# Altium schematic sheet RELAY17.SchDoc
size A
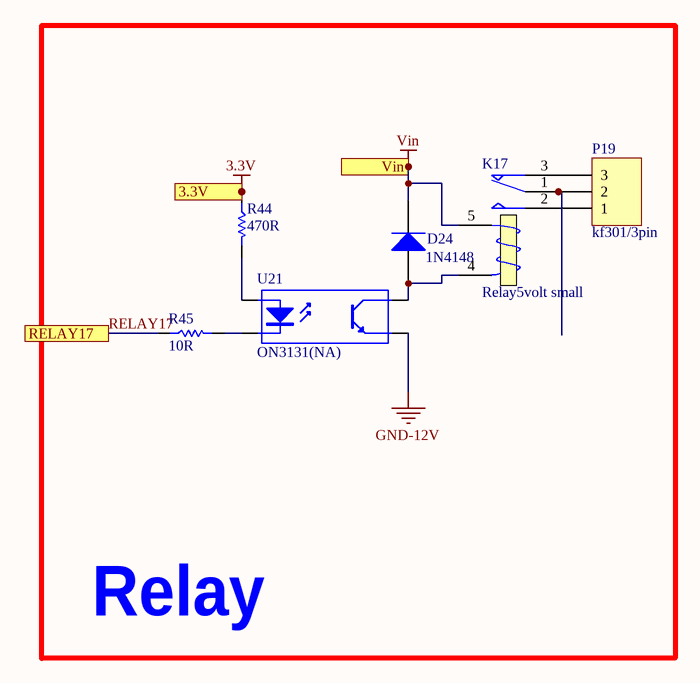
[diagram p0: RELAY17.SchDoc]

## Parts
D24  1N4148  [sod123]
K17  Relay5volt small  [relay5_childern]
P19  kf301/3pin  [Blue Connector 1*3 -kf301]
R44  470R  [0805/resistor]
R45  10R  [0805/resistor]
U21  ON3131(NA)  [OPTO_COUPLER]

## Blocks framed on the sheet
Relay: D24 K17 P19 R44 R45 U21

## Ports
3.3V, RELAY17, Vin

## Nets
3.3V: R44.1 ; port 3.3V
GND-12V: U21.3(E)
Vin: D24.K K17.5 ; port Vin
RELAY17: R45.1 ; port RELAY17
NetD24_A: D24.A K17.4(T2) U21.4(C)
NetK17_1: K17.1(COM) P19.2
NetK17_2: K17.2(NO) P19.1
NetK17_3: K17.3(T1) P19.3
NetR44_2: R44.2 U21.1(A)
NetR45_2: R45.2 U21.2(K)

## Library data of the parts
D24 = Diode 1N4007: 1 Amp General Purpose Rectifier; Published: 8-Jun-2000; LatestRevisionDate: 17-Jul-2002; LatestRevisionNote: Re-released for DXP Platform.; DatasheetVersion: 1998; PackageVersion: Aug-1999; PackageReference: DO-41; Publisher: Altium Limited; PackageDescription: Diode, Axial; Body 5.2 x 2.7 mm (LxDia. max), Lead Dia. 0.86 mm (max); Code_JEDEC: DO-204-AL; ComponentLink1Description: Manufacturer Link; ComponentLink1URL: http://www.fairchildsemi.com/; ComponentLink2Description: Datasheet; ComponentLink2URL: http://www.fairchildsemi.com/ds/1N%2F1N4001.pdf
K17 = Relay: SPDT Relay; Published: 8-Jun-2000; LatestRevisionDate: 17-Jul-2002; LatestRevisionNote: Re-released for DXP Platform.; PackageReference: MODULE5B; Publisher: Altium Limited
P19 = Header 3: LatestRevisionDate: 17-Jul-2002; LatestRevisionNote: Re-released for DXP Platform.; Publisher: Altium Limited
R44 R45 = Resistor: Tolerance: 5%; Power: 1/8 W
  R44: Value: 470R
  R45: Value: 10R
U21 = Optoisolator1: 4-Pin Phototransistor Optocoupler; Published: 24-Mar-1999; LatestRevisionDate: 04-Mar-2005; LatestRevisionNote: Sch pins 3 & 4 Swapped.; DatasheetVersion: Nov-2003; PackageReference: DIP-4; Publisher: Altium Limited